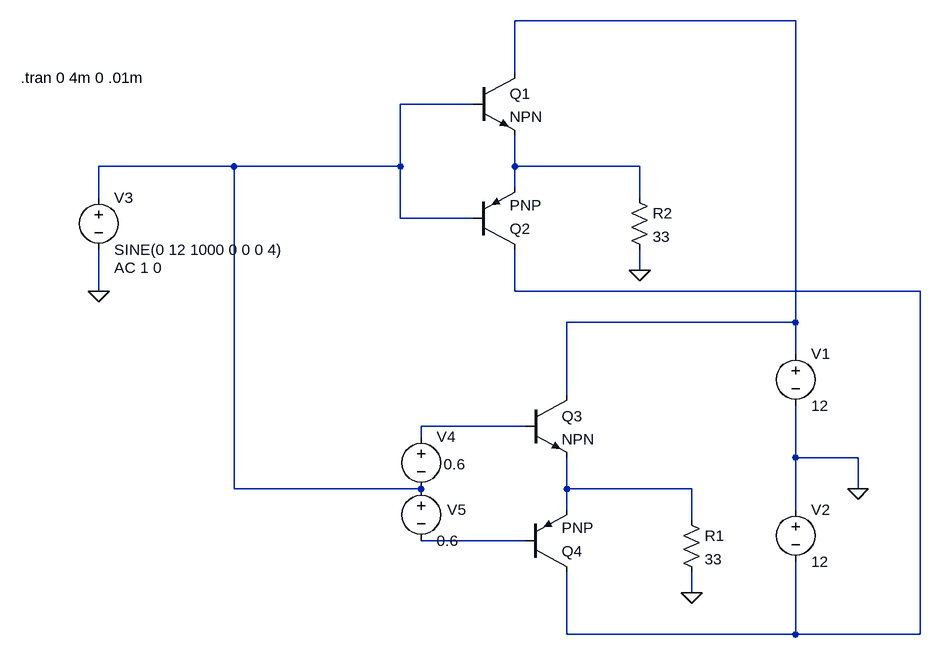
[diagram p0: schematic claseab8.asc]
claseab8.asc, the LTspice schematic file:
Version 4
SHEET 1 884 680
WIRE 688 -512 256 -512
WIRE 256 -432 256 -512
WIRE 192 -384 80 -384
WIRE -176 -288 -384 -288
WIRE 80 -288 80 -384
WIRE 80 -288 -176 -288
WIRE 256 -288 256 -336
WIRE 448 -288 256 -288
WIRE 256 -256 256 -288
WIRE -384 -240 -384 -288
WIRE 448 -240 448 -288
WIRE 80 -208 80 -288
WIRE 192 -208 80 -208
WIRE 448 -128 448 -160
WIRE -384 -96 -384 -160
WIRE 256 -96 256 -160
WIRE 880 -96 256 -96
WIRE 688 -48 688 -512
WIRE 688 -48 336 -48
WIRE 688 0 688 -48
WIRE 336 64 336 -48
WIRE 272 112 112 112
WIRE 112 128 112 112
WIRE 688 160 688 80
WIRE 784 160 688 160
WIRE -176 208 -176 -288
WIRE 112 208 -176 208
WIRE 336 208 336 160
WIRE 528 208 336 208
WIRE 784 208 784 160
WIRE 336 240 336 208
WIRE 688 240 688 160
WIRE 528 256 528 208
WIRE 272 288 112 288
WIRE 528 368 528 336
WIRE 336 432 336 336
WIRE 688 432 688 320
WIRE 688 432 336 432
WIRE 880 432 880 -96
WIRE 880 432 688 432
FLAG 784 208 0
FLAG -384 -96 0
FLAG 448 -128 0
FLAG 528 368 0
SYMBOL voltage 688 -16 R0
WINDOW 123 0 0 Left 2
WINDOW 39 0 0 Left 2
SYMATTR InstName V1
SYMATTR Value 12
SYMBOL voltage 688 224 R0
WINDOW 123 0 0 Left 2
WINDOW 39 0 0 Left 2
SYMATTR InstName V2
SYMATTR Value 12
SYMBOL voltage -384 -256 R0
WINDOW 123 24 124 Left 2
WINDOW 39 0 0 Left 2
SYMATTR Value2 AC 1 0
SYMATTR InstName V3
SYMATTR Value SINE(0 12 1000 0 0 0 4)
SYMBOL res 432 -256 R0
SYMATTR InstName R2
SYMATTR Value 33
SYMBOL npn 192 -432 R0
SYMATTR InstName Q1
SYMBOL pnp 192 -160 M180
SYMATTR InstName Q2
SYMBOL res 512 240 R0
SYMATTR InstName R1
SYMATTR Value 33
SYMBOL npn 272 64 R0
SYMATTR InstName Q3
SYMBOL pnp 272 336 M180
SYMATTR InstName Q4
SYMBOL voltage 112 112 R0
WINDOW 3 35 58 Left 2
WINDOW 123 0 0 Left 2
WINDOW 39 0 0 Left 2
SYMATTR InstName V4
SYMATTR Value 0.6
SYMBOL voltage 112 192 R0
WINDOW 0 40 48 Left 2
WINDOW 123 0 0 Left 2
WINDOW 39 0 0 Left 2
SYMATTR InstName V5
SYMATTR Value 0.6
TEXT -504 -424 Left 2 !.tran 0 4m 0 .01m

The netlist it stands for:
* claseab8.asc
V1 N001 0 12
V2 0 N004 12
V3 N002 0 SINE(0 12 1000 0 0 0 4) AC 1 0
R2 N003 0 33
Q1 N001 N002 N003 0 NPN
Q2 N004 N002 N003 0 PNP
R1 N006 0 33
Q3 N001 N005 N006 0 NPN
Q4 N004 N007 N006 0 PNP
V4 N005 N002 0.6
V5 N002 N007 0.6
.model NPN NPN
.model PNP PNP
.lib standard.bjt
.tran 0 4m 0 .01m
.backanno
.end